# Altium schematic sheet FoodFocus_SchematicDoc.SchDoc
size A; SheetNumber: 1; SheetTotal: 1
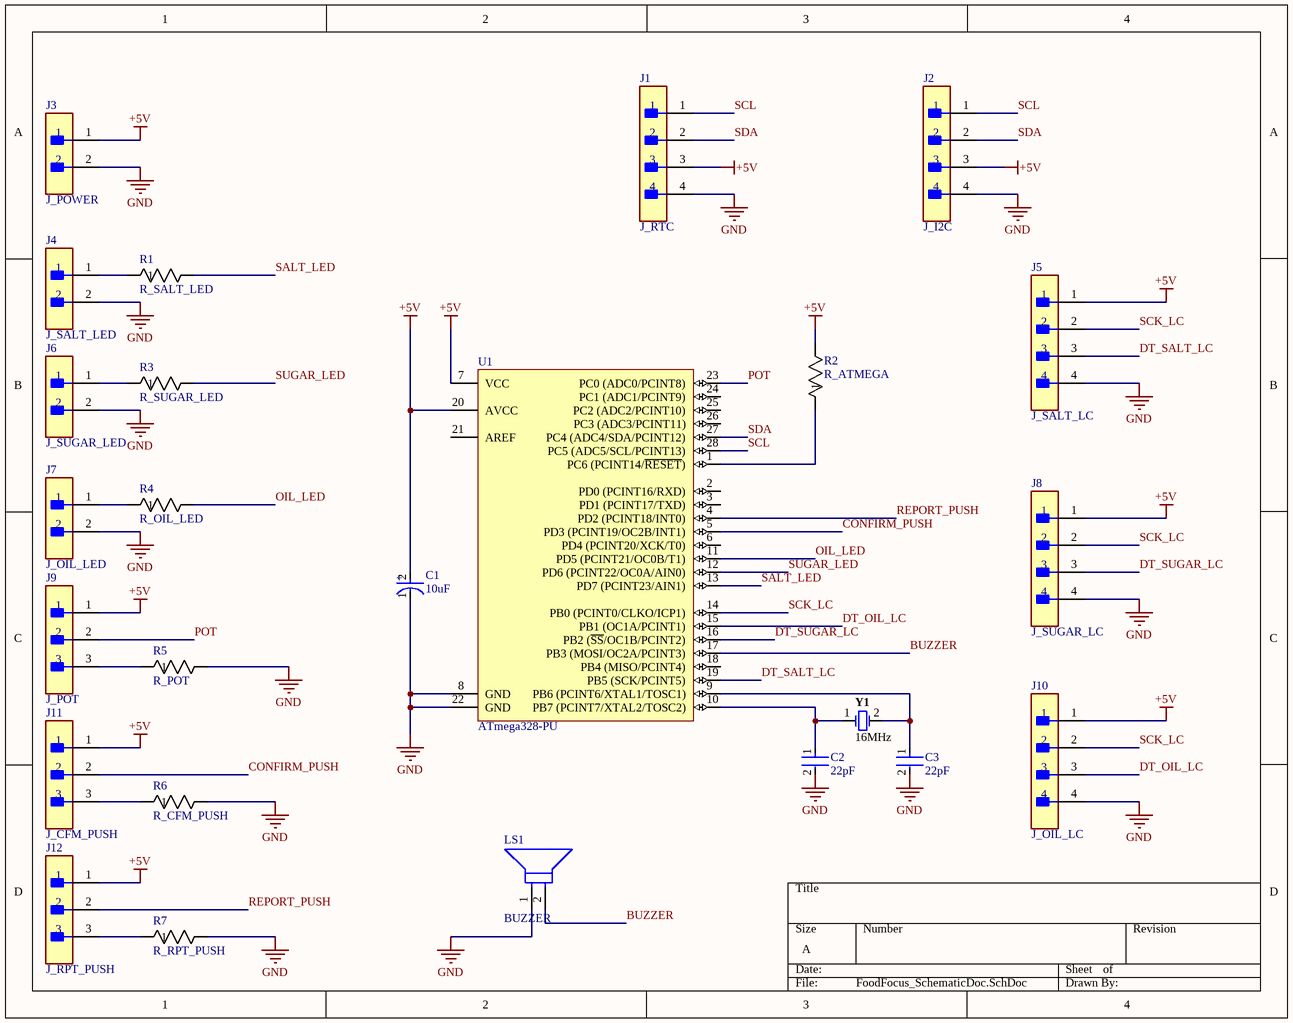
[diagram p0: FoodFocus_SchematicDoc.SchDoc]

## Parts
C1  10uF  [FP-RAD-TH-D_5_0_5-L_11_1-MFG]
C2  22pF  [FP-VY2472M49Y5UG63V7-MFG]
C3  22pF  [FP-VY2472M49Y5UG63V7-MFG]
J1  J_RTC  [FP-35312-0460-MFG]
J2  J_I2C  [FP-35312-0460-MFG]
J3  J_POWER  [FP-B2B-XH-A_LF_SN-MFG]
J4  J_SALT_LED  [FP-B2B-XH-A_LF_SN-MFG]
J5  J_SALT_LC  [FP-35312-0460-MFG]
J6  J_SUGAR_LED  [FP-B2B-XH-A_LF_SN-MFG]
J7  J_OIL_LED  [FP-B2B-XH-A_LF_SN-MFG]
J8  J_SUGAR_LC  [FP-35312-0460-MFG]
J9  J_POT  [FP-B3B-XH-A_LF_SN-MFG]
J10  J_OIL_LC  [FP-35312-0460-MFG]
J11  J_CFM_PUSH  [FP-B3B-XH-A_LF_SN-MFG]
J12  J_RPT_PUSH  [FP-B3B-XH-A_LF_SN-MFG]
LS1  BUZZER  [FP-MCKPX-G1203A-K4056-MFG]
R1  R_SALT_LED  [RES_AC01_VIS]
R2  R_ATMEGA  [RES_AC01_VIS]
R3  R_SUGAR_LED  [RES_AC01_VIS]
R4  R_OIL_LED  [RES_AC01_VIS]
R5  R_POT  [RES_AC01_VIS]
R6  R_CFM_PUSH  [RES_AC01_VIS]
R7  R_RPT_PUSH  [RES_AC01_VIS]
U1  ATmega328-PU  [28P3]
Y1  16MHz  [FOX-FOXSLF160-20]

## Nets
+5V: C1.2(A) J1.3 J2.3 J3.1 J5.1 J8.1 J9.1 J10.1 J11.1 J12.1 R2.2 U1.7(VCC) U1.20(AVCC)
GND: C1.1(C) C2.2 C3.2 J1.4 J2.4 J3.2 J4.2 J5.4 J6.2 J7.2 J8.4 J10.4 LS1.1(C) R5.2 R6.2 R7.2 U1.8(GND) U1.22(GND)
BUZZER: LS1.2(A) U1.17(PB3_(MOSI/OC2A/PCINT3))
CONFIRM_PUSH: J11.2 U1.5(PD3_(PCINT19/OC2B/INT1))
DT_OIL_LC: J10.3 U1.15(PB1_(OC1A/PCINT1))
DT_SALT_LC: J5.3 U1.19(PB5_(SCK/PCINT5))
DT_SUGAR_LC: J8.3 U1.16(PB2_(~{SS}/OC1B/PCINT2))
OIL_LED: R4.2 U1.11(PD5_(PCINT21/OC0B/T1))
POT: J9.2 U1.23(PC0_(ADC0/PCINT8))
REPORT_PUSH: J12.2 U1.4(PD2_(PCINT18/INT0))
SALT_LED: R1.2 U1.13(PD7_(PCINT23/AIN1))
SCK_LC: J5.2 J8.2 J10.2 U1.14(PB0_(PCINT0/CLKO/ICP1))
SCL: J1.1 J2.1 U1.28(PC5_(ADC5/SCL/PCINT13))
SDA: J1.2 J2.2 U1.27(PC4_(ADC4/SDA/PCINT12))
SUGAR_LED: R3.2 U1.12(PD6_(PCINT22/OC0A/AIN0))
NetC2_1: C2.1 U1.10(PB7_(PCINT7/XTAL2/TOSC2)) Y1.1
NetC3_1: C3.1 U1.9(PB6_(PCINT6/XTAL1/TOSC1)) Y1.2
NetJ4_1: J4.1 R1.1
NetJ6_1: J6.1 R3.1
NetJ7_1: J7.1 R4.1
NetJ9_3: J9.3 R5.1
NetJ11_3: J11.3 R6.1
NetJ12_3: J12.3 R7.1
NetR2_1: R2.1 U1.1(PC6_(PCINT14/~{RESET}))

Not connected (* = marked no-connect by the designer): U1 2(PD0_(PCINT16/RXD)) 3(PD1_(PCINT17/TXD)) 6(PD4_(PCINT20/XCK/T0)) 18(PB4_(MISO/PCINT4)) 21(AREF) 24(PC1_(ADC1/PCINT9)) 25(PC2_(ADC2/PCINT10)) 26(PC3_(ADC3/PCINT11))

## Notes on the sheet
- (in symbol CMP-05427-000869-1) +

## Library data of the parts
C1 = CMP-05427-000869-1: Aluminum Electrolytic Capacitors (Radial Lead Type) 10uF ±20% 100V; Polarity: Polar; Lead Diameter: 0.5mm; Dissipation Factor: 0.1%; Leakage Current: 3uA; Dielectric Material: Aluminium; Ripple Current: 70mA; Life (Hours): 2000Hour; Lead/Base Style: Straight; Length: 11mm; Case/Package: Radial; Lead Pitch: 2mm; Contact Plating: Tin; RoHS Compliant: Yes; Radiation Hardening: No; Capacitance: 10uF; Max Operating Temperature: 85°C; Lead Free: Lead Free; Termination: Radial; Voltage Rating: 100V; Package Quantity: 200; Voltage: 100V; Construction: RADIAL; Height: 11mm; Min Operating Temperature: -40°C; Diameter: 5mm; REACH SVHC: No SVHC; Tolerance: 20%; Width: 5mm; Height - Seated (Max): 0.472inch; Mount: Through Hole; Series: M; Voltage Rating (DC): 100V; Packaging: Bulk; Ripple Current (AC): 70mA; Number of Pins: 2
C2 C3 = CMP-02417-000047-1: Capacitor Ceramic 4700pF ±20% Y5U BULK RADIAL; Lead/Base Style: Kinked; Capacitance: 4.7nF; Voltage Rating (DC): 300V; Body Diameter: 12.5mm; Lead Diameter: 0.6mm; Dissipation Factor: 2.5%; Mount: Through Hole; Package Quantity: 1000; Packaging: Bulk; Case/Package: Radial; Resistor Type: Ceramic; Termination: Radial; Series: VY2; Dielectric: Y5U; RoHS Compliant: Yes; Weight: 0.040932oz; Height - Seated (Max): 0.65inch; Tolerance: 20%; Lead Pitch: 7.5mm; REACH SVHC: No SVHC; Voltage Rating: 300V; Thickness: 5mm; Diameter: 12.5mm; Voltage Rating (AC): 300V; Max Operating Temperature: 125°C; Min Operating Temperature: -40°C
J1 J2 J5 J8 J10 = CMP-04776-000928-1: CONN HEADER 4POS 2.5MM VERT; Contact Resistance: 20mR; Glow Wire Compliant: Non-compliant; Number of Contacts: 4; Contact Post Length: 3.4mm; Voltage Rating: 250V; Gender: Male; Current Rating: 3A; Max Operating Temperature: 105°C; RoHS Compliant: Yes; Number of Rows: 1; Mount: Through Hole; Contact Plating: Tin; Min Operating Temperature: -40°C; Number of Positions: 4; Contact Material: Brass; Housing Material: Nylon; Series: 35312; Packaging: Bulk; Termination: Solder; Package Quantity: 1000; Pitch: 2.5mm; Contact Gender: Male; Orientation: Vertical; Number of Circuits: 4
J3 J4 J6 J7 = CMP-2000-05888-3: CONN HEADER VERT 2POS 2.5MM; Current Rating: 3A; Voltage Rating: 250V; Number of Contacts: 2; Contact Resistance: 20mR; Wire/Cable Gauge: 22AWG; Insulation Resistance: 1GR; Connector Type: Male Pin; Packaging: Bulk; Contact Material: Brass; Lead Free: Lead Free; Orientation: Straight; Contact Plating: Tin; Max Current Rating: 3A; Termination: Solder; Fastening Type: Detent; Depth: 5.75mm; Housing Material: Polyamide; REACH SVHC: No SVHC; Series: XH; Voltage Rating (AC): 250V; Number of Positions: 2; Color: Natural; Contact Type: Male Pin; Max Voltage Rating (DC): 250V; Pitch: 2.5mm; Lead Pitch: 2.5mm; Mount: Through Hole; Max Operating Temperature: 85°C; Length: 7.4mm; Max Voltage Rating (AC): 250V; Min Operating Temperature: -25°C; Number of Rows: 1; Housing Color: White
J9 J11 J12 = CMP-17439-000014-3: CONN HEADER VERT 3POS 2.5MM; Max Voltage Rating (DC): 250V; Number of Positions: 3; Current Rating: 3A; Gender: Male; Wire/Cable Gauge: 22AWG; Contact Resistance: 20mR; Insulation Resistance: 1GR; Insulation Material: Nylon; Contact Plating: Tin; Depth: 5.75mm; Contact Type: Male Pin; Max Operating Temperature: 85°C; Insulation Color: Natural; Voltage Rating (AC): 250V; Color: Natural; Connector Type: Header; Orientation: Straight; Fastening Type: Detent; Housing Color: White; Min Operating Temperature: -25°C; Termination: Solder; Voltage Rating: 250V; Series: XH; Pitch: 2.5mm; Contact Shape: Square; Number of Rows: 1; Lead Free: Lead Free; Packaging: Bulk; Mount: Through Hole; Flammability Rating: UL94 V-0; Max Voltage Rating (AC): 250V; REACH SVHC: No SVHC; Housing Material: Polyamide; Contact Material: Brass; Lead Pitch: 2.5mm; Contact Finish - Mating: TIN; Length: 9.9mm; Max Current Rating: 3A; Number of Contacts: 3
LS1 = CMP-12433-000001-1: MAGNETIC BUZZER AND TRANSDUCER - More Details; Manufacturer Part Number: MCKPX-G1203A-K4056; Manufacturer: Multicomp Pro; Operating Supply Voltage: 3V; Current: 30mA; Frequency: 2300Hz; Max Supply Voltage: 5V; Min Supply Voltage: 2V; Standoff Height: 0.5mm; ComponentLink2Description: Datasheet; ComponentLink2URL: http://www.farnell.com/datasheets/1498149.pdf?_ga=2.17855225.1157923166.1572356775-536200964.1569240579; Temperature Range High: +70°C; Device Class L2: Audio Products; Temperature Range Low: -20°C; Package: 0; Temperature: -20°C to +70°C; Category: Speak; Octopart: https://octopart.com/mckpx-g1203a-k4056-multicomp-12157154; RoHS: TRUE; Lead Free: Yes; Height: 9.5mm; Device Class L1: Electromechanical; Automotive: No; Device Class L3: Buzzers
R1-R7 = CMP-00030-42338632-1: AC01000002200JA100 Resistor, 220 Ohm, ± 5%, 1 W, Axial Leaded, Wirewound, General Purpose; Power Rating: 1W; Resistance: 220Ω; Voltage Rating: 15V; Lead Diameter: 800µm; Temperature Coefficient: 180ppm/°C; Case/Package: Conformal; Features: Flame Retardant Coating; Number of Terminations: 2; Length: 11mm; Max Power Dissipation: 1W; RoHS: Compliant; Military Standard: Not; Tolerance: 5%; Diameter: 4.3mm; Composition: Wirewound; Lead Free: Lead Free; Termination: Axial; Contact Plating: Tin; REACH SVHC: Unknown; Max Operating Temperature: 275°C; Number of Pins: 2; Min Operating Temperature: -40°C; Schedule B: 8533210080, 8533210080; Packaging: Cut Tape (CT); Voltage Rating (DC): 15V; NexarPartId: 42338632
U1 = CMP-0095-00015-2: 8-bit AVR Microcontroller, 32KB Flash, 1KB EEPROM, 2KB SRAM, 28-pin PDIP, Industrial Grade (-40°C to 85°C); ComponentLink3Description: ATmega48A/48PA/88A/88PA/168A/168PA/328/328P Summary; RevisionNote: DatasheetVersion updated. URLs added.; DatasheetVersion: revD, May-2011; ComponentLink1URL: http://www.atmel.com/; PackageVersion: revB, Sep-2001; PackageDescription: 28-lead (0.300"/7.62mm Wide) Plastic Dual Inline Package (PDIP); PackageReference: 28P3; ComponentLink1Description: Manufacturer URL; ComponentLink2Description: ATmega48A/48PA/88A/88PA/168A/168PA/328/328P Datasheet; ComponentLink3URL: http://www.atmel.com/dyn/resources/prod_documents/8271S.pdf; ComponentLink2URL: http://www.atmel.com/dyn/resources/prod_documents/8271.pdf
Y1 = CMP-1749-00003-1: Resistance Weld Thru-Hole Crystal, 16 MHz, -20 to 70 degC, 2-Pin THD, RoHS, Bulk; Voltage Rating: 250 V; Tolerance: 1%; Resistance: 221 kohm; Case\Package: Axial; Power Rating: 250 mW; RoHSCompliant: true; Package Quantity: 200; Packaging: Bulk; Min Operating Temperature: -55 degC; DatasheetVersion: Mar-15; ComponentLink1URL: http://www.foxonline.com/; Max Operating Temperature: 155 degC; PackageReference: FOXSLF160-20; Mount: Through Hole; PackageDescription: 2-Pin Through Hole Device, Body 11.35 x 4.65 mm; ComponentLink1Description: Manufacturer URL; ComponentLink2URL: http://www.foxonline.com/pdfs/hc49slf.pdf; ComponentLink2Description: Datasheet; Length: 0.248 inch